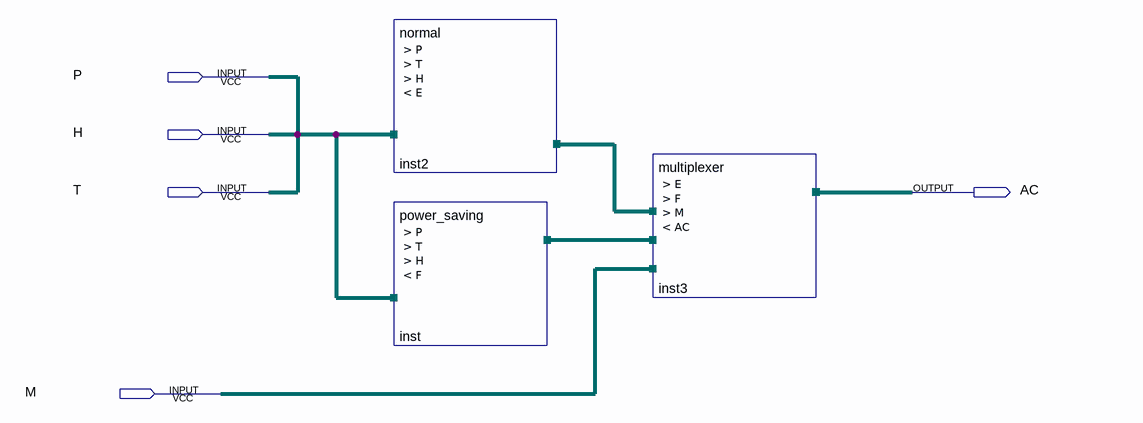
[diagram p0: schematic sheet]
// Quartus schematic lab4step4.bdf as structural Verilog: 3 symbols, 5 pins
module lab4step4 (
  input  P,
  input  H,
  input  T,
  input  M,
  output AC
);

  wire E, F;

  normal inst2 (.P(P), .T(T), .H(H), .E(E));
  power_saving inst (.P(P), .T(T), .H(H), .F(F));
  multiplexer inst3 (.E(E), .F(F), .M(M), .AC(AC));
endmodule
